# EAGLE design Thumb throttle switch v8 (EAGLE 7.6.0)
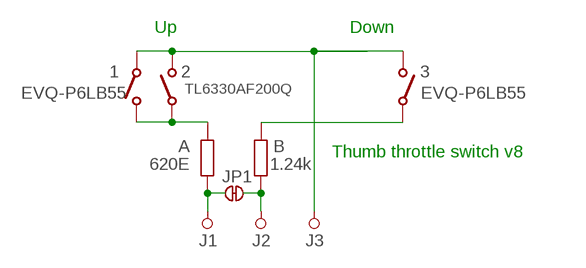
[diagram p0: schematic, sheet 1]

## Parts
1  EVQ-P6LB55  TACTILE-IP68  [TACTILE_SWITCH_SMD-2]
2  TL6330AF200Q  TACTILE4,6*2,8  [TACTILE_SWITCH_SMD_4.6X2.8MM]
3  EVQ-P6LB55  TACTILE-IP68  [TACTILE_SWITCH_SMD-2]
A  620E  SMD-R'  [0603]
B  1.24k  SMD-R'  [0603]
J1  nc  PIN0.3MM  [PIN-0.3MM]
J2  nc  PIN0.3MM  [PIN-0.3MM]
J3  nc  PIN0.3MM  [PIN-0.3MM]
JP1  nc  JUMPER_SJ_NCNC  [JUMPER_NC]

## Nets
J1: A.1 J1.1 JP1.1 JP1.1A
J2: B.1 J2.1 JP1.2 JP1.2B
J3: 1.2(P) 2.1(O) 2.4(O) 3.1(O) J3.1
N$1: 1.1(O) 2.2(P) 2.3(P) A.2
N$2: 3.2(P) B.2

## Notes on the sheet
- Up | Down
- Thumb throttle switch v8

## Library data of the parts
1-3 = ALBERT:TACTILE
A B = ALBERT:SMD-R: Resistor
J1-J3 = ALBERT:PIN: PIN HEADER
JP1 = ALBERT:JUMPER_SJ_NC: SMD solder JUMPER

## Board
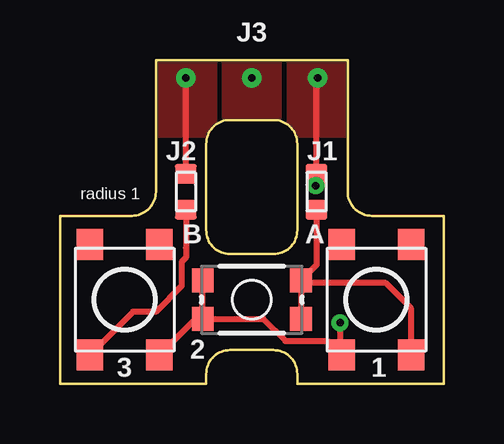
[diagram p1: board, top side]
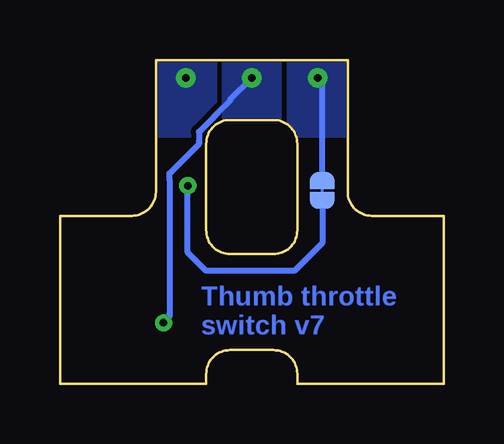
[diagram p2: board, bottom side, seen from below]

Size 16 x 13.5 mm. Coordinates in mm from the lower left corner, seen from the top.
Outline: 7.1,1.4 8.9,1.4 arc-90 9.9,0.4 9.9,0 16,0 16,7 13,7 arc-90 12,8 12,13.5 4,13.5 4,8 arc-90 3,7 0,7 0,0 6.1,0 6.1,0.4 arc-90 7.1,1.4
Outline: 9.9,6.4 9.9,10 arc90 8.9,11 7.1,11 arc90 6.1,10 6.1,6.4 arc90 7.1,5.4 8.9,5.4 arc90 9.9,6.4
Copper layers (1*16): Top 0.035mm / dielectric 1.5mm / Bottom 0.035mm
Design rules "default *": minimum track width 10mil, minimum drill 24mil, track to track 8mil, track to pad 8mil, pad to pad 8mil, via to via 8mil, smd to smd 8mil, copper to edge 1mil, drill to drill 8mil, minimum pad ring 10mil, minimum via ring 8mil, stop-mask expansion 4mil, vias tented up to drill 0mil, thermal gap 10mil

### Footprints (pad centres in the part's own frame; a part is rotated, then mirrored left to right if it is on the bottom)
TACTILE_SWITCH_SMD-2 = smd 1.3 x 1.1: 1 2.3,1.45; 2 2.3,-1.45; 3 -2.3,-1.45; 4 -2.3,1.45
TACTILE_SWITCH_SMD_4.6X2.8MM = smd 0.9 x 1: 1 -2.05,-0.8; 2 2.05,-0.8; 3 2.05,0.8; 4 -2.05,0.8
0603 = smd 0.9 x 0.8: 1 0,0.75; 2 0,-0.75
PIN-0.3MM = drill 0.3: 1 0,0
JUMPER_NC = smd 0.635 x 1.016: 1 -0.445,0; 2 0.445,0 | smd 0.381 x 1.016: 1A -0.254,0; 2B 0.254,0

### Placement (x,y rotation side)
1  13.2,3.5 270 top
2  8,3.5 0 top
3  2.7,3.5 270 top
A  10.7,8 0 top
B  5.25,8 0 top
J1  10.75,12.75 0 top
J2  5.25,12.75 0 top
J3  8,12.75 0 top
JP1  5.06,8.06 90 bottom

### Tracks (layer width: path | path; a pad name or v marks a point on that pad's centre or on a via)
J1  (via drill 0.3)
  Top 0.254: 10.92,8.67 A.1 | v10.67,8.26 10.67,8.72 A.1 | A.1 10.7,12.3 10.7,12.7 J1.1
  Bottom 0.254: JP1.1A 5.06,5.86 6.22,4.7 9.91,4.7 10.67,5.46 v10.67,8.26
  pour Top (no thermals): 9.5,13.5 12,13.5 12,10.3 9.5,10.3
  pour Bottom (no thermals): 12,13.5 9.5,13.5 9.5,10.3 12,10.3
J2
  Top 0.254: B.1 5.25,12.25 J2.1
  Bottom 0.254: JP1.2 JP1.2B JP1.2 | JP1.2 5.06,12.06 5.06,12.56 J2.1
  pour Top (no thermals): 6.5,13.5 6.5,10.3 4,10.3 4,13.5
  pour Bottom (no thermals): 4,13.6 4,10.3 6.5,10.3 6.5,13.6
J3  (via drill 0.3)
  Top 0.254: 2.1 2.4 | 2.1 5.65,2.7 3.1 | 2.1 8.48,2.7 9.4,1.78 11.17,1.78 1.2 11.68,1.27 v11.68,2.54
  Bottom 0.254: J3.1 8.2,12.5 | 8.26,12.49 J3.1 | J3.1 8.89,11.86 8.89,11.81 9.4,11.3 9.53,11.18 9.6,11.1 10.2,10.5 10.2,10.1 10.2,9.99 10.29,9.91 11.43,8.76 11.43,8.51 11.43,2.92 11.43,2.79 v11.68,2.54
  pour Top (no thermals): 6.8,13.5 9.2,13.5 9.2,11.1 6.8,11.1
  pour Bottom (no thermals): 9.2,13.5 6.8,13.5 6.8,11 9.2,11
N$1
  Top 0.254: 2.3 2.2 | A.2 10.7,4.95 2.3 | 1.1 14.65,3.13 13.59,4.19 10.16,4.19 2.3
N$2
  Top 0.254: B.2 5.25,5.67 5.25,5.25 5.08,5.08 5.08,4.08 4,3 3.05,3 3.2 1.25,1.38

### Text on the board
Bottom: Thumb throttle / switch v7
tPlace: radius 1